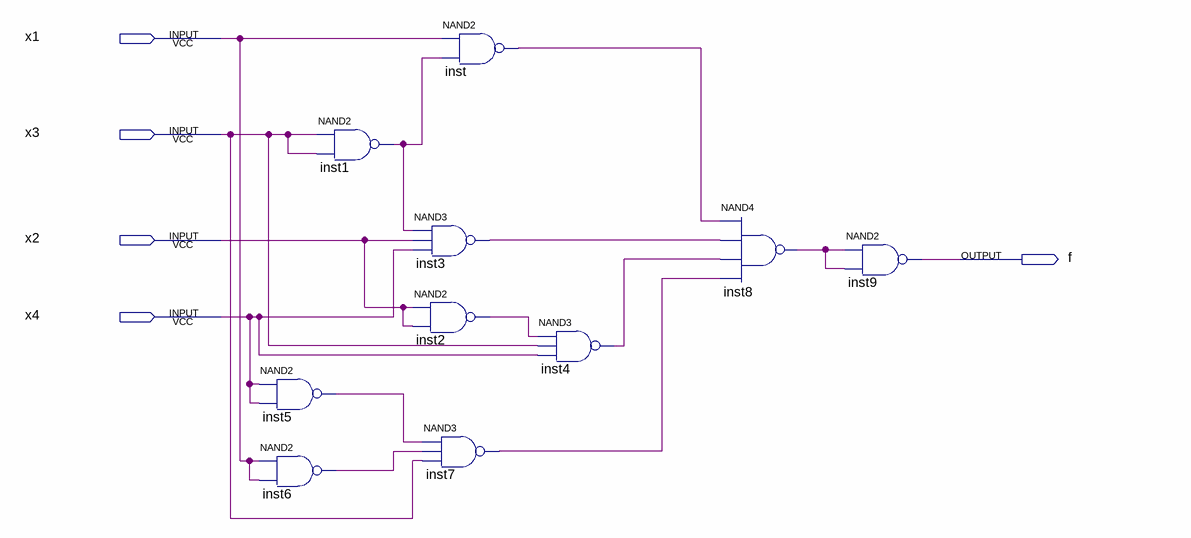
[diagram p0: schematic sheet]
// Quartus schematic lab2Schematic.bdf as structural Verilog: 10 symbols, 5 pins
module lab2Schematic (
  input  x1,
  input  x3,
  input  x2,
  input  x4,
  output f
);

  wire inst1_out, inst2_out, inst3_out, inst4_out, inst5_out, inst6_out, inst7_out, inst8_out, inst_out;

  nand inst5 (inst5_out, x4, x4);
  nand inst6 (inst6_out, x1, x1);
  nand inst1 (inst1_out, x3, x3);
  nand inst (inst_out, x1, inst1_out);
  nand inst3 (inst3_out, inst1_out, x2, x4);
  nand inst2 (inst2_out, x2, x2);
  nand inst7 (inst7_out, inst5_out, inst6_out, x3);
  nand inst4 (inst4_out, inst2_out, x3, x4);
  nand inst8 (inst8_out, inst_out, inst3_out, inst4_out, inst7_out);
  nand inst9 (f, inst8_out, inst8_out);
endmodule
